# Altium schematic sheet CM_FMC-HPC-AB.SchDoc
size Tabloid; SheetNumber: 12; SheetTotal: 14; Sheet_Name: CM_FMC-HPC-AB; Size: 11x17
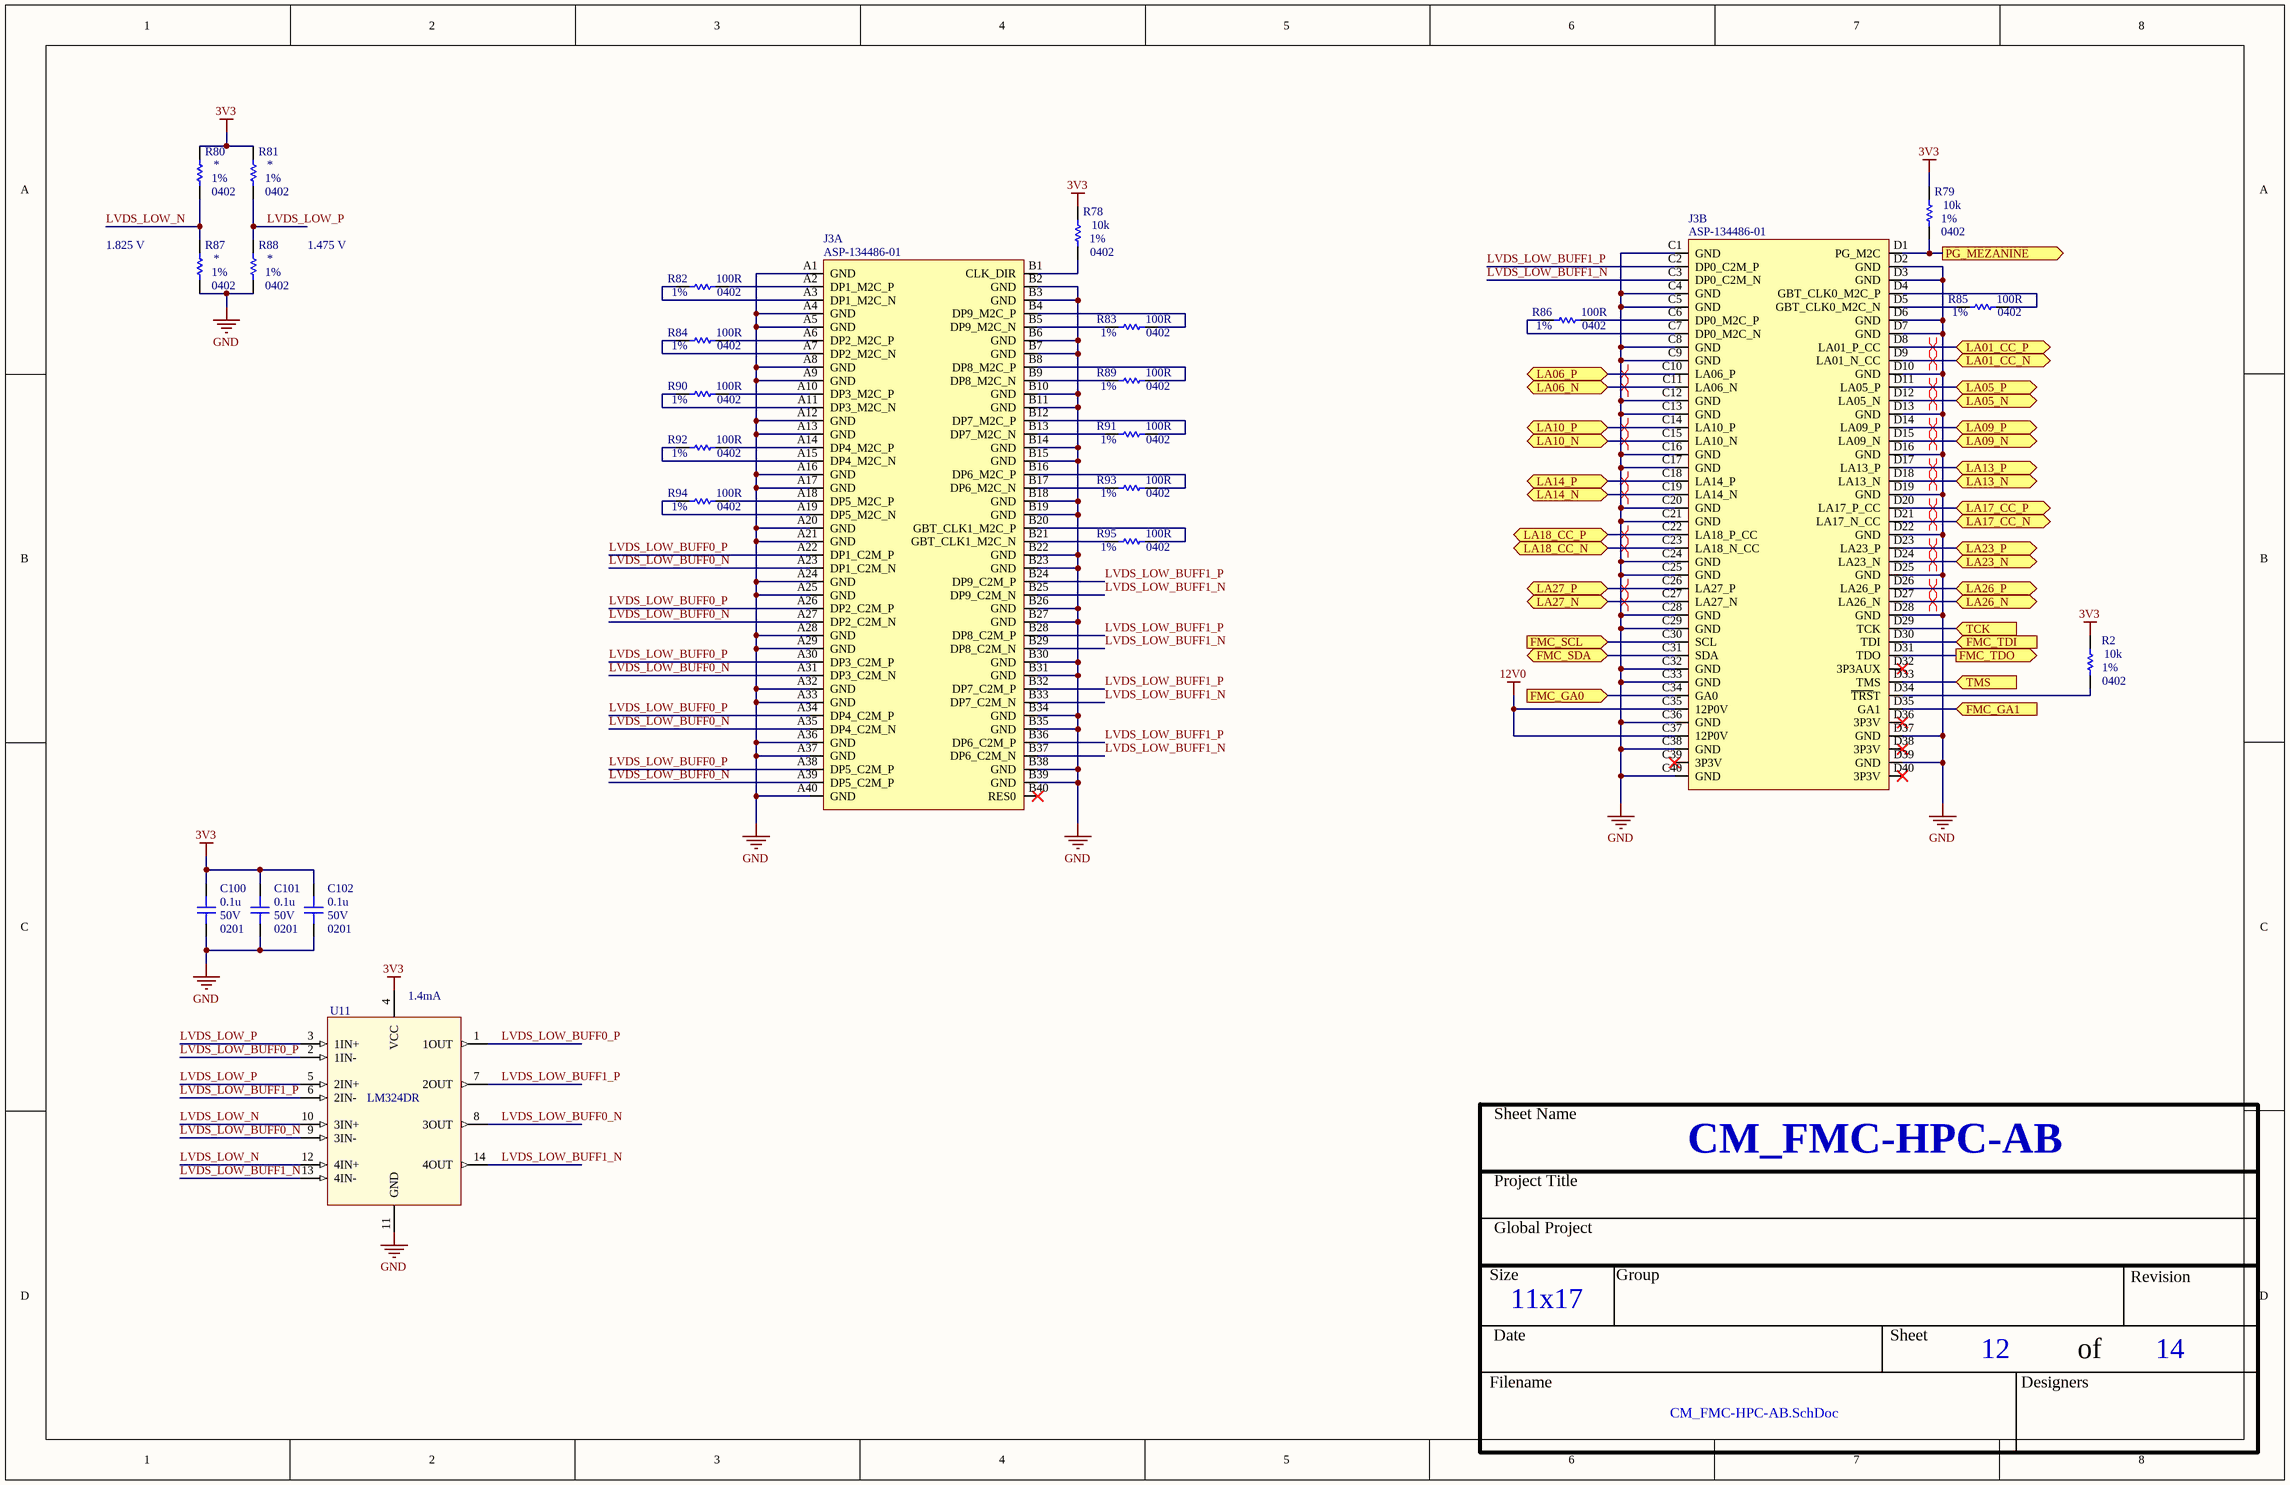
[diagram p0: CM_FMC-HPC-AB.SchDoc]

## Parts
C100  value 0.1u  Voltage: 50V  Package: 0201  [CAP_0201]  (hidden comment: CAP - 0201)
C101  value 0.1u  Voltage: 50V  Package: 0201  [CAP_0201]  (hidden comment: CAP - 0201)
C102  value 0.1u  Voltage: 50V  Package: 0201  [CAP_0201]  (hidden comment: CAP - 0201)
J3  ASP-134486-01  [CONN_SAMTEC_ASP-134486-01]  (parts A,B of 5)
R2  value 10k  Package: 0402  Precision: 1%  [RES_0402]  (hidden comment: RES - 0402)
R78  value 10k  Package: 0402  Precision: 1%  [RES_0402]  (hidden comment: RES - 0402)
R79  value 10k  Package: 0402  Precision: 1%  [RES_0402]  (hidden comment: RES - 0402)
R80  Package: 0402  Precision: 1%  [RES_0402]  (hidden comment: RES - 0402)
R81  Package: 0402  Precision: 1%  [RES_0402]  (hidden comment: RES - 0402)
R82  value 100R  Package: 0402  Precision: 1%  [RES_0402]  (hidden comment: RES - 0402)
R83  value 100R  Package: 0402  Precision: 1%  [RES_0402]  (hidden comment: RES - 0402)
R84  value 100R  Package: 0402  Precision: 1%  [RES_0402]  (hidden comment: RES - 0402)
R85  value 100R  Package: 0402  Precision: 1%  [RES_0402]  (hidden comment: RES - 0402)
R86  value 100R  Package: 0402  Precision: 1%  [RES_0402]  (hidden comment: RES - 0402)
R87  Package: 0402  Precision: 1%  [RES_0402]  (hidden comment: RES - 0402)
R88  Package: 0402  Precision: 1%  [RES_0402]  (hidden comment: RES - 0402)
R89  value 100R  Package: 0402  Precision: 1%  [RES_0402]  (hidden comment: RES - 0402)
R90  value 100R  Package: 0402  Precision: 1%  [RES_0402]  (hidden comment: RES - 0402)
R91  value 100R  Package: 0402  Precision: 1%  [RES_0402]  (hidden comment: RES - 0402)
R92  value 100R  Package: 0402  Precision: 1%  [RES_0402]  (hidden comment: RES - 0402)
R93  value 100R  Package: 0402  Precision: 1%  [RES_0402]  (hidden comment: RES - 0402)
R94  value 100R  Package: 0402  Precision: 1%  [RES_0402]  (hidden comment: RES - 0402)
R95  value 100R  Package: 0402  Precision: 1%  [RES_0402]  (hidden comment: RES - 0402)
U11  LM324DR  [SOIC127P600X175-14N]

## Ports
FMC_GA0 (in), FMC_GA1 (in), FMC_SCL (in), FMC_SDA (bidir), FMC_TDI (in), FMC_TDO (out), LA01_CC_N (bidir), LA01_CC_P (bidir), LA05_N (bidir), LA05_P (bidir), LA06_N (bidir), LA06_P (bidir), LA09_N (bidir), LA09_P (bidir), LA10_N (bidir), LA10_P (bidir), LA13_N (bidir), LA13_P (bidir), LA14_N (bidir), LA14_P (bidir), LA17_CC_N (bidir), LA17_CC_P (bidir), LA18_CC_N (bidir), LA18_CC_P (bidir), LA23_N (bidir), LA23_P (bidir), LA26_N (bidir), LA26_P (bidir), LA27_N (bidir), LA27_P (bidir), PG_MEZANINE (out), TCK (in), TMS (in)

## Nets
3V3: C100.2 C101.2 C102.2 R2.2 R78.2 R79.2 R80.2 R81.2 U11.4(VCC)
12V0: J3.C35(12P0V) J3.C37(12P0V)
GND: C100.1 C101.1 C102.1 J3.A1(GND) J3.A4(GND) J3.A5(GND) J3.A8(GND) J3.A9(GND) J3.A12(GND) J3.A13(GND) J3.A16(GND) J3.A17(GND) J3.A20(GND) J3.A21(GND) J3.A24(GND) J3.A25(GND) J3.A28(GND) J3.A29(GND) J3.A32(GND) J3.A33(GND) J3.A36(GND) J3.A37(GND) J3.A40(GND) J3.B2(GND) J3.B3(GND) J3.B6(GND) J3.B7(GND) J3.B10(GND) J3.B11(GND) J3.B14(GND) J3.B15(GND) J3.B18(GND) J3.B19(GND) J3.B22(GND) J3.B23(GND) J3.B26(GND) J3.B27(GND) J3.B30(GND) J3.B31(GND) J3.B34(GND) J3.B35(GND) J3.B38(GND) J3.B39(GND) J3.C1(GND) J3.C4(GND) J3.C5(GND) J3.C8(GND) J3.C9(GND) J3.C12(GND) J3.C13(GND) J3.C16(GND) J3.C17(GND) J3.C20(GND) J3.C21(GND) J3.C24(GND) J3.C25(GND) J3.C28(GND) J3.C29(GND) J3.C32(GND) J3.C33(GND) J3.C36(GND) J3.C38(GND) J3.C40(GND) J3.D2(GND) J3.D3(GND) J3.D6(GND) J3.D7(GND) J3.D10(GND) J3.D13(GND) J3.D16(GND) J3.D19(GND) J3.D22(GND) J3.D25(GND) J3.D28(GND) J3.D37(GND) J3.D39(GND) R87.1 R88.1 U11.11(GND)
FMC_GA0: J3.C34(GA0) ; port FMC_GA0
FMC_GA1: J3.D35(GA1) ; port FMC_GA1
FMC_SCL: J3.C30(SCL) ; port FMC_SCL
FMC_SDA: J3.C31(SDA) ; port FMC_SDA
FMC_TDI: J3.D30(TDI) ; port FMC_TDI
FMC_TDO: J3.D31(TDO) ; port FMC_TDO
LA01_CC_N: J3.D9(LA01_N_CC) ; port LA01_CC_N
LA01_CC_P: J3.D8(LA01_P_CC) ; port LA01_CC_P
LA05_N: J3.D12(LA05_N) ; port LA05_N
LA05_P: J3.D11(LA05_P) ; port LA05_P
LA06_N: J3.C11(LA06_N) ; port LA06_N
LA06_P: J3.C10(LA06_P) ; port LA06_P
LA09_N: J3.D15(LA09_N) ; port LA09_N
LA09_P: J3.D14(LA09_P) ; port LA09_P
LA10_N: J3.C15(LA10_N) ; port LA10_N
LA10_P: J3.C14(LA10_P) ; port LA10_P
LA13_N: J3.D18(LA13_N) ; port LA13_N
LA13_P: J3.D17(LA13_P) ; port LA13_P
LA14_N: J3.C19(LA14_N) ; port LA14_N
LA14_P: J3.C18(LA14_P) ; port LA14_P
LA17_CC_N: J3.D21(LA17_N_CC) ; port LA17_CC_N
LA17_CC_P: J3.D20(LA17_P_CC) ; port LA17_CC_P
LA18_CC_N: J3.C23(LA18_N_CC) ; port LA18_CC_N
LA18_CC_P: J3.C22(LA18_P_CC) ; port LA18_CC_P
LA23_N: J3.D24(LA23_N) ; port LA23_N
LA23_P: J3.D23(LA23_P) ; port LA23_P
LA26_N: J3.D27(LA26_N) ; port LA26_N
LA26_P: J3.D26(LA26_P) ; port LA26_P
LA27_N: J3.C27(LA27_N) ; port LA27_N
LA27_P: J3.C26(LA27_P) ; port LA27_P
LVDS_LOW_BUFF0_N: J3.A23(DP1_C2M_N) J3.A27(DP2_C2M_N) J3.A31(DP3_C2M_N) J3.A35(DP4_C2M_N) J3.A39(DP5_C2M_P) U11.8(3OUT) U11.9(3IN-)
LVDS_LOW_BUFF0_P: J3.A22(DP1_C2M_P) J3.A26(DP2_C2M_P) J3.A30(DP3_C2M_P) J3.A34(DP4_C2M_P) J3.A38(DP5_C2M_P) U11.1(1OUT) U11.2(1IN-)
LVDS_LOW_BUFF1_N: J3.B25(DP9_C2M_N) J3.B29(DP8_C2M_N) J3.B33(DP7_C2M_N) J3.B37(DP6_C2M_N) J3.C3(DP0_C2M_N) U11.13(4IN-) U11.14(4OUT)
LVDS_LOW_BUFF1_P: J3.B24(DP9_C2M_P) J3.B28(DP8_C2M_P) J3.B32(DP7_C2M_P) J3.B36(DP6_C2M_P) J3.C2(DP0_C2M_P) U11.6(2IN-) U11.7(2OUT)
LVDS_LOW_N: R80.1 R87.2 U11.10(3IN+) U11.12(4IN+)
LVDS_LOW_P: R81.1 R88.2 U11.3(1IN+) U11.5(2IN+)
PG_MEZANINE: J3.D1(PG_M2C) R79.1 ; port PG_MEZANINE
TCK: J3.D29(TCK) ; port TCK
TMS: J3.D33(TMS) ; port TMS
NetJ3_A2: J3.A2(DP1_M2C_P) R82.1
NetJ3_A3: J3.A3(DP1_M2C_N) R82.2
NetJ3_A6: J3.A6(DP2_M2C_P) R84.1
NetJ3_A7: J3.A7(DP2_M2C_N) R84.2
NetJ3_A10: J3.A10(DP3_M2C_P) R90.1
NetJ3_A11: J3.A11(DP3_M2C_N) R90.2
NetJ3_A14: J3.A14(DP4_M2C_P) R92.1
NetJ3_A15: J3.A15(DP4_M2C_N) R92.2
NetJ3_A18: J3.A18(DP5_M2C_P) R94.1
NetJ3_A19: J3.A19(DP5_M2C_N) R94.2
NetJ3_B1: J3.B1(CLK_DIR) R78.1
NetJ3_B4: J3.B4(DP9_M2C_P) R83.2
NetJ3_B5: J3.B5(DP9_M2C_N) R83.1
NetJ3_B8: J3.B8(DP8_M2C_P) R89.2
NetJ3_B9: J3.B9(DP8_M2C_N) R89.1
NetJ3_B12: J3.B12(DP7_M2C_P) R91.2
NetJ3_B13: J3.B13(DP7_M2C_N) R91.1
NetJ3_B16: J3.B16(DP6_M2C_P) R93.2
NetJ3_B17: J3.B17(DP6_M2C_N) R93.1
NetJ3_B20: J3.B20(GBT_CLK1_M2C_P) R95.2
NetJ3_B21: J3.B21(GBT_CLK1_M2C_N) R95.1
NetJ3_C6: J3.C6(DP0_M2C_P) R86.1
NetJ3_C7: J3.C7(DP0_M2C_N) R86.2
NetJ3_D4: J3.D4(GBT_CLK0_M2C_P) R85.2
NetJ3_D5: J3.D5(GBT_CLK0_M2C_N) R85.1
NetJ3_D34: J3.D34(~{TRS}T) R2.1

Not connected (* = marked no-connect by the designer): J3 B40(RES0)* C39(3P3V)* D32(3P3AUX)* D36(3P3V)* D38(3P3V)* D40(3P3V)*

## Layout directives
differential pair: LA01_CC_N, LA01_CC_P, LA05_N, LA05_P, LA06_N, LA06_P, LA09_N, LA09_P, LA10_N, LA10_P, LA13_N, LA13_P, LA14_N, LA14_P, LA17_CC_N, LA17_CC_P, LA18_CC_N, LA18_CC_P, LA23_N, LA23_P, LA26_N, LA26_P, LA27_N, LA27_P

## Notes on the sheet
- 1.825 V
- 1.475 V
- (near U11) 1.4mA
- Sheet Name
- Project Title
- Global Project
- Size
- Group
- Revision
- Date
- Sheet
- of
- Filename
- Designers

## Library data of the parts
C100-C102 = CAP - 0201: Precision: 10%; Current: *; CreatedBy: Jonathan Bouchard; Power: *
J3 = CONN_SAMTEC_ASP-134486-01: CONN - VITA 57 MEZZ FEMALE (MOTHERBOARD) HIGH DENSITY - SMD-400; Voltage: 240VAC; Current: 1.8A; Mfg: Samtec; Power: *; Mfg Part Number: ASP-134486-01; HelpURL: http://suddendocs.samtec.com/prints/asp-134486-01-mkt.pdf; CreatedBy: Jonathan Bouchard; Temperature: -55 °C to +125 °C; Value: *; Precision: *; Package: SMD-400
R2 R78-R95 = RES - 0402: Voltage: 50V; Power: 1/16W; Current: *; CreatedBy: Jonathan Bouchard
  R80 R81 R87 R88: Value: *
U11 = LM324DR: OP Amp Quad GP Â±16V/32V 14-Pin SOIC T/R; MF: Rohm; Digi-Key_Purchase_URL: https://www.digikey.ca/product-detail/en/rohm-semiconductor/LM324DR/LM324DRRS-ND/4003944?utm_source=snapeda&utm_medium=aggregator&utm_campaign=symbol; SnapEDA_Link: https://www.snapeda.com/parts/LM324DR/Rohm/view-part/?ref=snap; Digi-Key_Part_Number: LM324DRRS-ND; Package: SOIC-14 Rohm; MP: LM324DR; Value: *